# EasyEDA schematic schematic.json
TITLE: Sheet_1; REV: 1.0; Date: 2024-10-04; Sheet: 1/1; Drawn By: saumil707; Company: Your Company
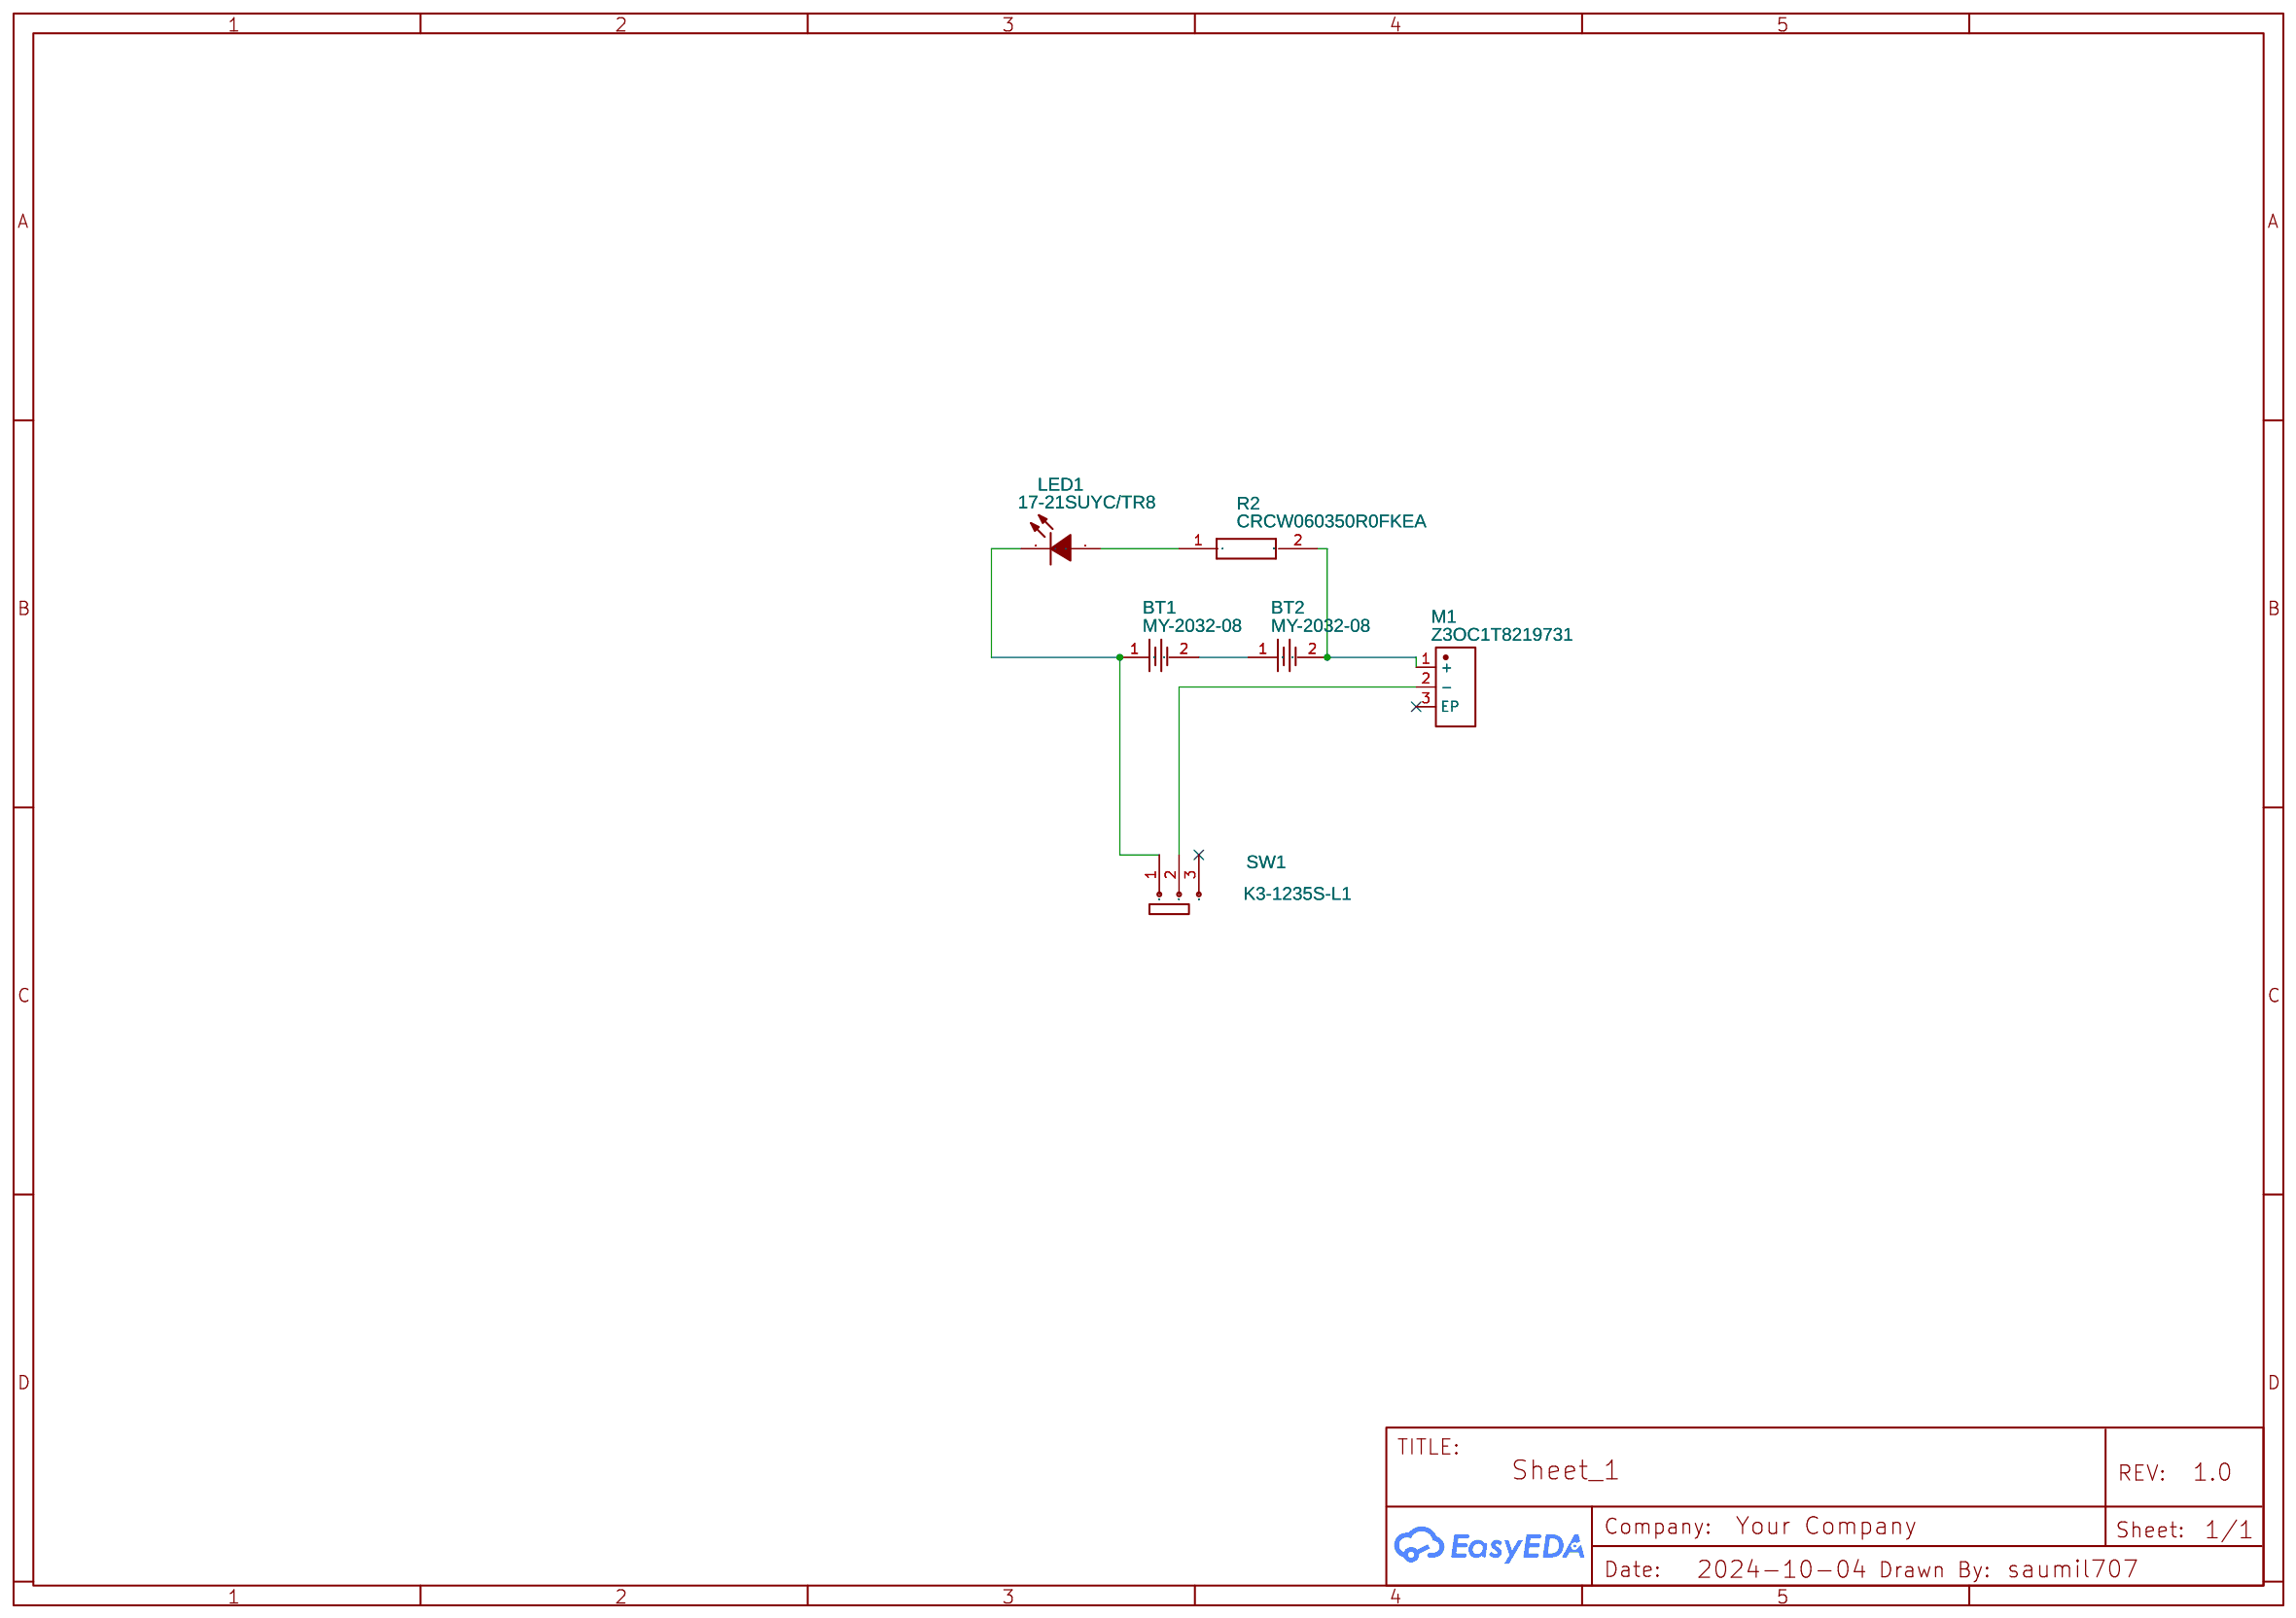
[diagram p0: schematic sheet]

## Parts
BT1  MY-2032-08  [BAT-SMD_MY-2032-08]
BT2  MY-2032-08  [BAT-SMD_MY-2032-08]
LED1  17-21SUYC/TR8  [LED0805-R-RD]
M1  Z3OC1T8219731  [VIBRATING-MOTOR-SMD_3P-C9900001680]
R2  CRCW060350R0FKEA  [RESC1608X50N]
SW1  K3-1235S-L1  [SW-TH_K3-1235S-L1]

## Library data of the parts
BT1 BT2 = MY-2032-08: Contributor: LCSC; Supplier: LCSC; Supplier Part: C964831; Manufacturer: MYOUNG(美阳); JLCPCB Part Class: Extended Part
LED1 = 17-21SUYC/TR8: Supplier: LCSC; Manufacturer: KENTO; Manufacturer Part: KT-0805黄灯; Supplier Part: C2296; JLCPCB Part Class: Basic Part
M1 = Z3OC1T8219731: Contributor: LCSC; Supplier: LCSC; Supplier Part: C2894731; Manufacturer: KOTL(金龙机电); JLCPCB Part Class: Extended Part
R2 = CRCW060350R0FKEA: Contributor: elpotthoff
SW1 = K3-1235S-L1: Contributor: LCSC; Supplier: LCSC; Supplier Part: C223838; Manufacturer: 韩国韩荣; JLCPCB Part Class: Extended Part

## Nets
Net-(BT1-1): BT1.1 LED1.2(-) SW1.1
Net-(BT1-2): BT1.2 BT2.1
Net-(BT2-2): BT2.2 M1.1(+) R2.2
Net-(LED1-1): LED1.1(+) R2.1
Net-(M1-2): M1.2(-) SW1.2

Not connected (* = marked no-connect by the designer): M1 3(EP)*; SW1 3*
